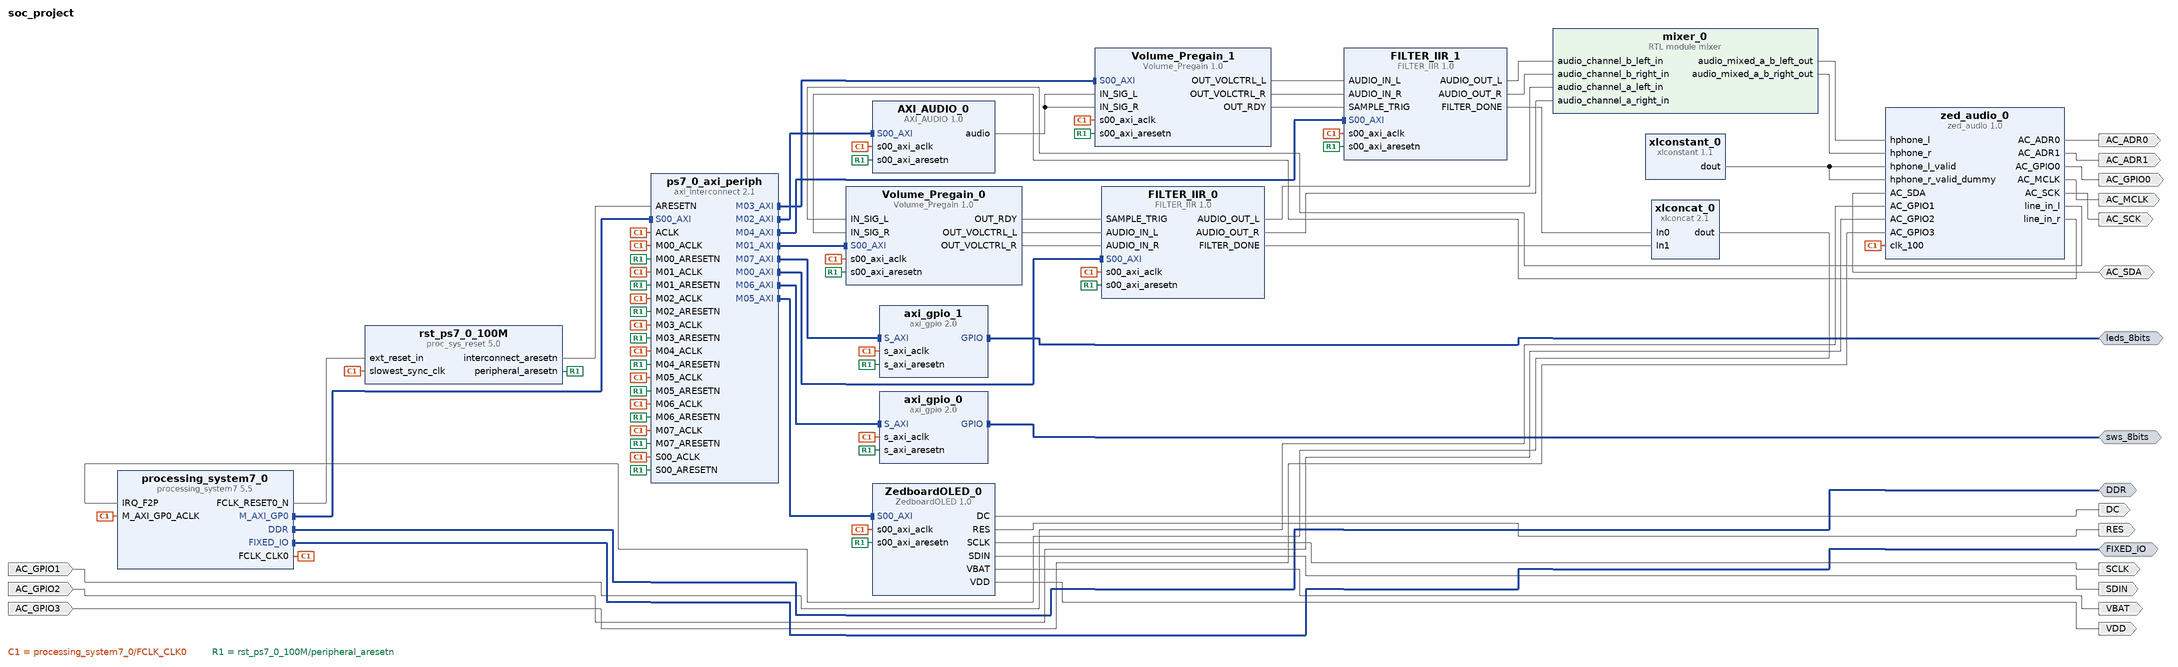
[diagram p0: block diagram of the top level]
# Vivado block design soc_project, xc7z020clg484-1, Vivado 2017.3
create_bd_design soc_project

create_bd_intf_port -mode Master -vlnv xilinx.com:interface:ddrx_rtl:1.0 DDR
create_bd_intf_port -mode Master -vlnv xilinx.com:display_processing_system7:fixedio_rtl:1.0 FIXED_IO
create_bd_intf_port -mode Master -vlnv xilinx.com:interface:gpio_rtl:1.0 sws_8bits
create_bd_intf_port -mode Master -vlnv xilinx.com:interface:gpio_rtl:1.0 leds_8bits
create_bd_port -dir O AC_ADR0
create_bd_port -dir O AC_ADR1
create_bd_port -dir O AC_GPIO0
create_bd_port -dir I AC_GPIO1
create_bd_port -dir I AC_GPIO2
create_bd_port -dir I AC_GPIO3
create_bd_port -dir O AC_MCLK
create_bd_port -dir O AC_SCK
create_bd_port -dir IO AC_SDA
create_bd_port -dir O DC
create_bd_port -dir O RES
create_bd_port -dir O SCLK
create_bd_port -dir O SDIN
create_bd_port -dir O VBAT
create_bd_port -dir O VDD

create_bd_cell -type ip -vlnv xilinx.com:ip:processing_system7:5.5 processing_system7_0
set_property -dict [list \
  CONFIG.PCW_UIPARAM_DDR_FREQ_MHZ 533.333313 \
  CONFIG.PCW_APU_PERIPHERAL_FREQMHZ 666.666667 \
  CONFIG.PCW_SDIO_PERIPHERAL_FREQMHZ 50 \
  CONFIG.PCW_UART_PERIPHERAL_FREQMHZ 50 \
  CONFIG.PCW_FPGA0_PERIPHERAL_FREQMHZ 100.000000 \
  CONFIG.PCW_FPGA1_PERIPHERAL_FREQMHZ 150.000000 \
  CONFIG.PCW_USE_FABRIC_INTERRUPT 1 \
  CONFIG.PCW_IRQ_F2P_INTR 1 \
  CONFIG.PCW_PRESET_BANK1_VOLTAGE {LVCMOS 1.8V} \
  CONFIG.PCW_UIPARAM_DDR_PARTNO {MT41J128M16 HA-15E} \
  CONFIG.PCW_QSPI_PERIPHERAL_ENABLE 1 \
  CONFIG.PCW_QSPI_QSPI_IO {MIO 1 .. 6} \
  CONFIG.PCW_QSPI_GRP_SINGLE_SS_ENABLE 1 \
  CONFIG.PCW_QSPI_GRP_SINGLE_SS_IO {MIO 1 .. 6} \
  CONFIG.PCW_SINGLE_QSPI_DATA_MODE x4 \
  CONFIG.PCW_ENET0_PERIPHERAL_ENABLE 1 \
  CONFIG.PCW_ENET0_ENET0_IO {MIO 16 .. 27} \
  CONFIG.PCW_ENET0_GRP_MDIO_ENABLE 1 \
  CONFIG.PCW_ENET0_GRP_MDIO_IO {MIO 52 .. 53} \
  CONFIG.PCW_ENET_RESET_ENABLE 1 \
  CONFIG.PCW_ENET_RESET_SELECT {Share reset pin} \
  CONFIG.PCW_ENET0_RESET_ENABLE 0 \
  CONFIG.PCW_SD0_PERIPHERAL_ENABLE 1 \
  CONFIG.PCW_SD0_SD0_IO {MIO 40 .. 45} \
  CONFIG.PCW_SD0_GRP_CD_ENABLE 1 \
  CONFIG.PCW_SD0_GRP_CD_IO {MIO 47} \
  CONFIG.PCW_SD0_GRP_WP_ENABLE 1 \
  CONFIG.PCW_SD0_GRP_WP_IO {MIO 46} \
  CONFIG.PCW_UART1_PERIPHERAL_ENABLE 1 \
  CONFIG.PCW_UART1_UART1_IO {MIO 48 .. 49} \
  CONFIG.PCW_TTC0_PERIPHERAL_ENABLE 1 \
  CONFIG.PCW_TTC0_TTC0_IO EMIO \
  CONFIG.PCW_USB0_PERIPHERAL_ENABLE 1 \
  CONFIG.PCW_USB0_USB0_IO {MIO 28 .. 39} \
  CONFIG.PCW_USB_RESET_ENABLE 1 \
  CONFIG.PCW_USB_RESET_SELECT {Share reset pin} \
  CONFIG.PCW_USB0_RESET_ENABLE 0 \
  CONFIG.PCW_I2C_RESET_ENABLE 1 \
  CONFIG.PCW_GPIO_MIO_GPIO_ENABLE 1 \
  CONFIG.PCW_GPIO_MIO_GPIO_IO MIO \
  CONFIG.preset ZedBoard \
] [get_bd_cells processing_system7_0]
# 224 more settings of processing_system7_0 are not shown: defaults, MIO pin electricals, DDR timing, and values the tool derives
create_bd_cell -type ip -vlnv ttu.ee:user:zed_audio:1.0 zed_audio_0
create_bd_cell -type ip -vlnv xilinx.com:ip:xlconstant:1.1 xlconstant_0
create_bd_cell -type ip -vlnv tsotnep:userLibrary:FILTER_IIR:1.0 FILTER_IIR_0
create_bd_cell -type ip -vlnv xilinx.com:ip:axi_interconnect:2.1 ps7_0_axi_periph
set_property -dict {CONFIG.NUM_MI 8} [get_bd_cells ps7_0_axi_periph]
create_bd_cell -type ip -vlnv xilinx.com:ip:proc_sys_reset:5.0 rst_ps7_0_100M
create_bd_cell -type ip -vlnv tsotnep:userLibrary:Volume_Pregain:1.0 Volume_Pregain_0
create_bd_cell -type ip -vlnv ttu.ee:user:AXI_AUDIO:1.0 AXI_AUDIO_0
create_bd_cell -type ip -vlnv tsotnep:userLibrary:Volume_Pregain:1.0 Volume_Pregain_1
create_bd_cell -type ip -vlnv tsotnep:userLibrary:FILTER_IIR:1.0 FILTER_IIR_1
create_bd_cell -type module -reference mixer mixer_0
create_bd_cell -type ip -vlnv xilinx.com:ip:xlconcat:2.1 xlconcat_0
create_bd_cell -type ip -vlnv tamu.edu:user:ZedboardOLED:1.0 ZedboardOLED_0
create_bd_cell -type ip -vlnv xilinx.com:ip:axi_gpio:2.0 axi_gpio_0
set_property -dict {CONFIG.USE_BOARD_FLOW true CONFIG.GPIO_BOARD_INTERFACE sws_8bits} [get_bd_cells axi_gpio_0]
create_bd_cell -type ip -vlnv xilinx.com:ip:axi_gpio:2.0 axi_gpio_1
set_property -dict {CONFIG.USE_BOARD_FLOW true CONFIG.GPIO_BOARD_INTERFACE leds_8bits} [get_bd_cells axi_gpio_1]

# ---- connections ----

connect_bd_intf_net [get_bd_intf_pins processing_system7_0/M_AXI_GP0] [get_bd_intf_pins ps7_0_axi_periph/S00_AXI]
connect_bd_intf_net [get_bd_intf_pins ps7_0_axi_periph/M00_AXI] [get_bd_intf_pins FILTER_IIR_0/S00_AXI]
connect_bd_intf_net [get_bd_intf_pins ps7_0_axi_periph/M01_AXI] [get_bd_intf_pins Volume_Pregain_0/S00_AXI]
connect_bd_intf_net [get_bd_intf_pins ps7_0_axi_periph/M02_AXI] [get_bd_intf_pins AXI_AUDIO_0/S00_AXI]
connect_bd_intf_net [get_bd_intf_pins ps7_0_axi_periph/M03_AXI] [get_bd_intf_pins Volume_Pregain_1/S00_AXI]
connect_bd_intf_net [get_bd_intf_pins ps7_0_axi_periph/M04_AXI] [get_bd_intf_pins FILTER_IIR_1/S00_AXI]
connect_bd_intf_net [get_bd_intf_pins ps7_0_axi_periph/M05_AXI] [get_bd_intf_pins ZedboardOLED_0/S00_AXI]
connect_bd_intf_net [get_bd_intf_pins ps7_0_axi_periph/M06_AXI] [get_bd_intf_pins axi_gpio_0/S_AXI]
connect_bd_intf_net [get_bd_intf_pins ps7_0_axi_periph/M07_AXI] [get_bd_intf_pins axi_gpio_1/S_AXI]
connect_bd_intf_net [get_bd_intf_ports DDR] [get_bd_intf_pins processing_system7_0/DDR]
connect_bd_intf_net [get_bd_intf_ports FIXED_IO] [get_bd_intf_pins processing_system7_0/FIXED_IO]
connect_bd_intf_net [get_bd_intf_ports sws_8bits] [get_bd_intf_pins axi_gpio_0/GPIO]
connect_bd_intf_net [get_bd_intf_ports leds_8bits] [get_bd_intf_pins axi_gpio_1/GPIO]
connect_bd_net [get_bd_pins processing_system7_0/FCLK_CLK0] \
  [get_bd_pins processing_system7_0/M_AXI_GP0_ACLK] [get_bd_pins zed_audio_0/clk_100] \
  [get_bd_pins rst_ps7_0_100M/slowest_sync_clk] [get_bd_pins FILTER_IIR_0/s00_axi_aclk] \
  [get_bd_pins Volume_Pregain_0/s00_axi_aclk] [get_bd_pins AXI_AUDIO_0/s00_axi_aclk] \
  [get_bd_pins Volume_Pregain_1/s00_axi_aclk] [get_bd_pins FILTER_IIR_1/s00_axi_aclk] \
  [get_bd_pins ZedboardOLED_0/s00_axi_aclk] [get_bd_pins axi_gpio_0/s_axi_aclk] [get_bd_pins ps7_0_axi_periph/S00_ACLK] \
  [get_bd_pins ps7_0_axi_periph/M00_ACLK] [get_bd_pins ps7_0_axi_periph/ACLK] [get_bd_pins ps7_0_axi_periph/M01_ACLK] \
  [get_bd_pins ps7_0_axi_periph/M02_ACLK] [get_bd_pins ps7_0_axi_periph/M03_ACLK] [get_bd_pins ps7_0_axi_periph/M04_ACLK] \
  [get_bd_pins ps7_0_axi_periph/M05_ACLK] [get_bd_pins ps7_0_axi_periph/M06_ACLK] [get_bd_pins axi_gpio_1/s_axi_aclk] \
  [get_bd_pins ps7_0_axi_periph/M07_ACLK]
connect_bd_net [get_bd_pins zed_audio_0/AC_ADR0] [get_bd_ports AC_ADR0]
connect_bd_net [get_bd_pins zed_audio_0/AC_ADR1] [get_bd_ports AC_ADR1]
connect_bd_net [get_bd_pins zed_audio_0/AC_GPIO0] [get_bd_ports AC_GPIO0]
connect_bd_net -net AC_GPIO1_1 [get_bd_ports AC_GPIO1] [get_bd_pins zed_audio_0/AC_GPIO1]
connect_bd_net -net AC_GPIO2_1 [get_bd_ports AC_GPIO2] [get_bd_pins zed_audio_0/AC_GPIO2]
connect_bd_net -net AC_GPIO3_1 [get_bd_ports AC_GPIO3] [get_bd_pins zed_audio_0/AC_GPIO3]
connect_bd_net [get_bd_pins zed_audio_0/AC_MCLK] [get_bd_ports AC_MCLK]
connect_bd_net [get_bd_pins zed_audio_0/AC_SCK] [get_bd_ports AC_SCK]
connect_bd_net [get_bd_ports AC_SDA] [get_bd_pins zed_audio_0/AC_SDA]
connect_bd_net [get_bd_pins xlconstant_0/dout] [get_bd_pins zed_audio_0/hphone_l_valid] [get_bd_pins zed_audio_0/hphone_r_valid_dummy]
connect_bd_net [get_bd_pins processing_system7_0/FCLK_RESET0_N] [get_bd_pins rst_ps7_0_100M/ext_reset_in]
connect_bd_net [get_bd_pins rst_ps7_0_100M/peripheral_aresetn] \
  [get_bd_pins FILTER_IIR_0/s00_axi_aresetn] [get_bd_pins Volume_Pregain_0/s00_axi_aresetn] \
  [get_bd_pins AXI_AUDIO_0/s00_axi_aresetn] [get_bd_pins Volume_Pregain_1/s00_axi_aresetn] \
  [get_bd_pins FILTER_IIR_1/s00_axi_aresetn] [get_bd_pins ZedboardOLED_0/s00_axi_aresetn] \
  [get_bd_pins axi_gpio_0/s_axi_aresetn] [get_bd_pins ps7_0_axi_periph/S00_ARESETN] \
  [get_bd_pins ps7_0_axi_periph/M00_ARESETN] [get_bd_pins ps7_0_axi_periph/M01_ARESETN] \
  [get_bd_pins ps7_0_axi_periph/M02_ARESETN] [get_bd_pins ps7_0_axi_periph/M03_ARESETN] \
  [get_bd_pins ps7_0_axi_periph/M04_ARESETN] [get_bd_pins ps7_0_axi_periph/M05_ARESETN] \
  [get_bd_pins ps7_0_axi_periph/M06_ARESETN] [get_bd_pins axi_gpio_1/s_axi_aresetn] \
  [get_bd_pins ps7_0_axi_periph/M07_ARESETN]
connect_bd_net [get_bd_pins rst_ps7_0_100M/interconnect_aresetn] [get_bd_pins ps7_0_axi_periph/ARESETN]
connect_bd_net [get_bd_pins Volume_Pregain_0/OUT_RDY] [get_bd_pins FILTER_IIR_0/SAMPLE_TRIG]
connect_bd_net [get_bd_pins Volume_Pregain_0/OUT_VOLCTRL_L] [get_bd_pins FILTER_IIR_0/AUDIO_IN_L]
connect_bd_net [get_bd_pins Volume_Pregain_0/OUT_VOLCTRL_R] [get_bd_pins FILTER_IIR_0/AUDIO_IN_R]
connect_bd_net [get_bd_pins zed_audio_0/line_in_l] [get_bd_pins Volume_Pregain_0/IN_SIG_L]
connect_bd_net [get_bd_pins zed_audio_0/line_in_r] [get_bd_pins Volume_Pregain_0/IN_SIG_R]
connect_bd_net [get_bd_pins AXI_AUDIO_0/audio] [get_bd_pins Volume_Pregain_1/IN_SIG_L] [get_bd_pins Volume_Pregain_1/IN_SIG_R]
connect_bd_net [get_bd_pins Volume_Pregain_1/OUT_VOLCTRL_L] [get_bd_pins FILTER_IIR_1/AUDIO_IN_L]
connect_bd_net [get_bd_pins Volume_Pregain_1/OUT_VOLCTRL_R] [get_bd_pins FILTER_IIR_1/AUDIO_IN_R]
connect_bd_net [get_bd_pins Volume_Pregain_1/OUT_RDY] [get_bd_pins FILTER_IIR_1/SAMPLE_TRIG]
connect_bd_net [get_bd_pins FILTER_IIR_0/AUDIO_OUT_L] [get_bd_pins mixer_0/audio_channel_a_left_in]
connect_bd_net [get_bd_pins FILTER_IIR_0/AUDIO_OUT_R] [get_bd_pins mixer_0/audio_channel_a_right_in]
connect_bd_net [get_bd_pins mixer_0/audio_mixed_a_b_left_out] [get_bd_pins zed_audio_0/hphone_l]
connect_bd_net [get_bd_pins mixer_0/audio_mixed_a_b_right_out] [get_bd_pins zed_audio_0/hphone_r]
connect_bd_net [get_bd_pins FILTER_IIR_1/AUDIO_OUT_L] [get_bd_pins mixer_0/audio_channel_b_left_in]
connect_bd_net [get_bd_pins FILTER_IIR_1/AUDIO_OUT_R] [get_bd_pins mixer_0/audio_channel_b_right_in]
connect_bd_net [get_bd_pins xlconcat_0/dout] [get_bd_pins processing_system7_0/IRQ_F2P]
connect_bd_net [get_bd_pins FILTER_IIR_0/FILTER_DONE] [get_bd_pins xlconcat_0/In1]
connect_bd_net [get_bd_pins FILTER_IIR_1/FILTER_DONE] [get_bd_pins xlconcat_0/In0]
connect_bd_net [get_bd_pins ZedboardOLED_0/DC] [get_bd_ports DC]
connect_bd_net [get_bd_pins ZedboardOLED_0/RES] [get_bd_ports RES]
connect_bd_net [get_bd_pins ZedboardOLED_0/SCLK] [get_bd_ports SCLK]
connect_bd_net [get_bd_pins ZedboardOLED_0/SDIN] [get_bd_ports SDIN]
connect_bd_net [get_bd_pins ZedboardOLED_0/VBAT] [get_bd_ports VBAT]
connect_bd_net [get_bd_pins ZedboardOLED_0/VDD] [get_bd_ports VDD]

# ---- address map ----
assign_bd_address -offset 0x41200000 -range 64K -target_address_space [get_bd_addr_spaces processing_system7_0/Data] [get_bd_addr_segs axi_gpio_0/S_AXI/Reg]
assign_bd_address -offset 0x41210000 -range 64K -target_address_space [get_bd_addr_spaces processing_system7_0/Data] [get_bd_addr_segs axi_gpio_1/S_AXI/Reg]
assign_bd_address -offset 0x43C00000 -range 64K -target_address_space [get_bd_addr_spaces processing_system7_0/Data] [get_bd_addr_segs FILTER_IIR_0/S00_AXI/S00_AXI_reg]
assign_bd_address -offset 0x43C10000 -range 64K -target_address_space [get_bd_addr_spaces processing_system7_0/Data] [get_bd_addr_segs Volume_Pregain_0/S00_AXI/S00_AXI_reg]
assign_bd_address -offset 0x43C20000 -range 64K -target_address_space [get_bd_addr_spaces processing_system7_0/Data] [get_bd_addr_segs AXI_AUDIO_0/S00_AXI/S00_AXI_reg]
assign_bd_address -offset 0x43C30000 -range 64K -target_address_space [get_bd_addr_spaces processing_system7_0/Data] [get_bd_addr_segs Volume_Pregain_1/S00_AXI/S00_AXI_reg]
assign_bd_address -offset 0x43C40000 -range 64K -target_address_space [get_bd_addr_spaces processing_system7_0/Data] [get_bd_addr_segs FILTER_IIR_1/S00_AXI/S00_AXI_reg]
assign_bd_address -offset 0x43C50000 -range 64K -target_address_space [get_bd_addr_spaces processing_system7_0/Data] [get_bd_addr_segs ZedboardOLED_0/S00_AXI/S00_AXI_reg]

validate_bd_design
save_bd_design
